# Altium schematic sheet MotorControl.SchDoc
size A2; DocumentNumber: 2; SheetNumber: 2; SheetTotal: 9
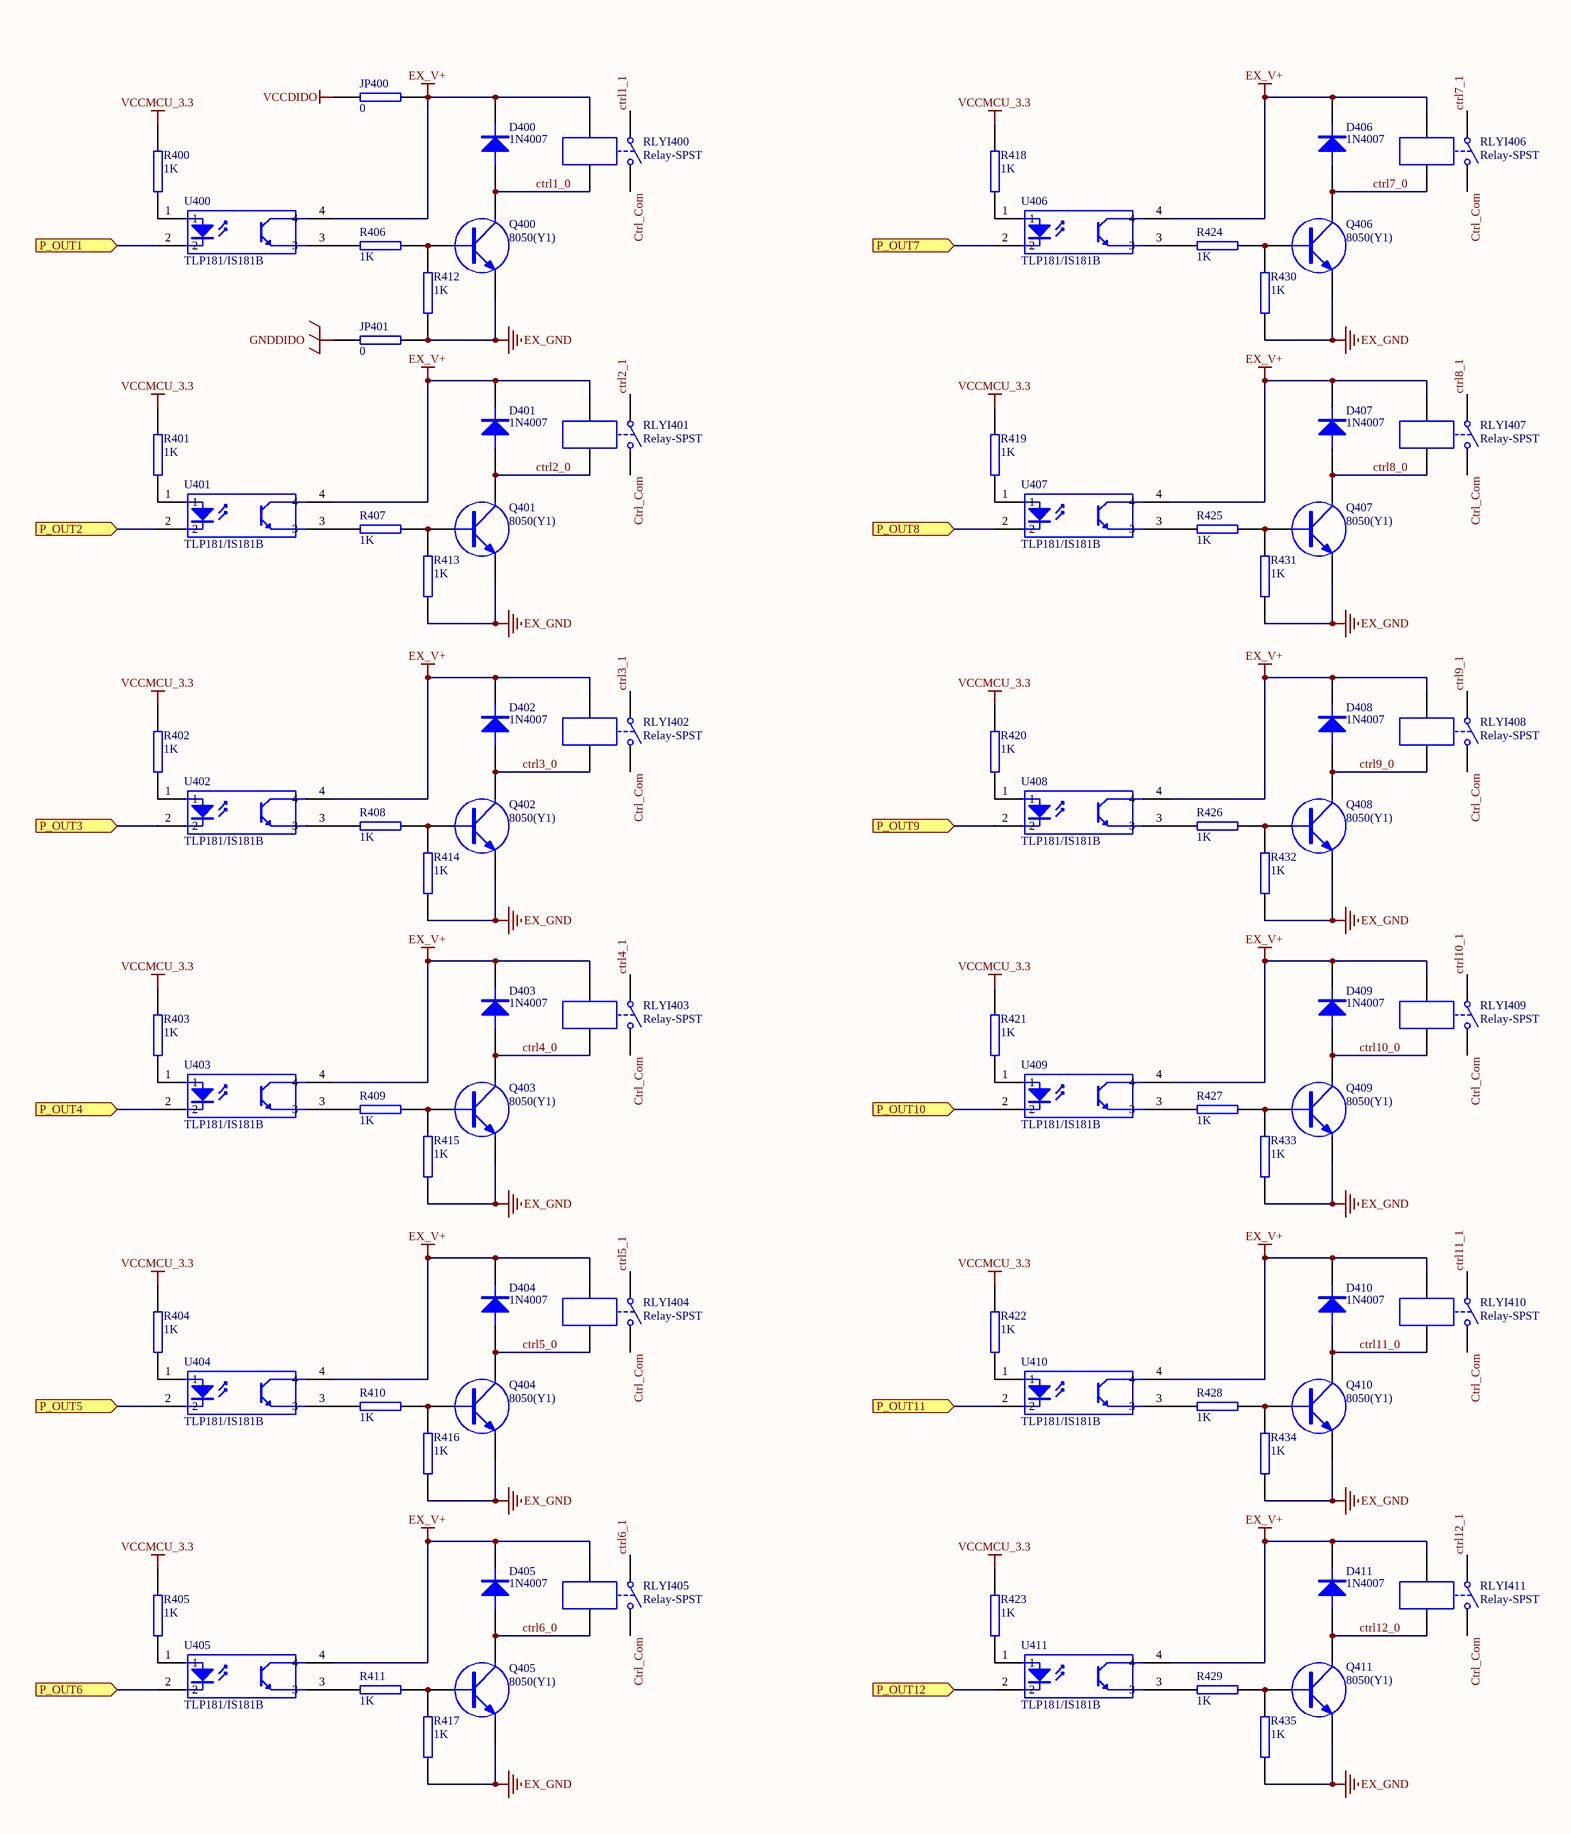
[diagram p0: MotorControl.SchDoc, left]
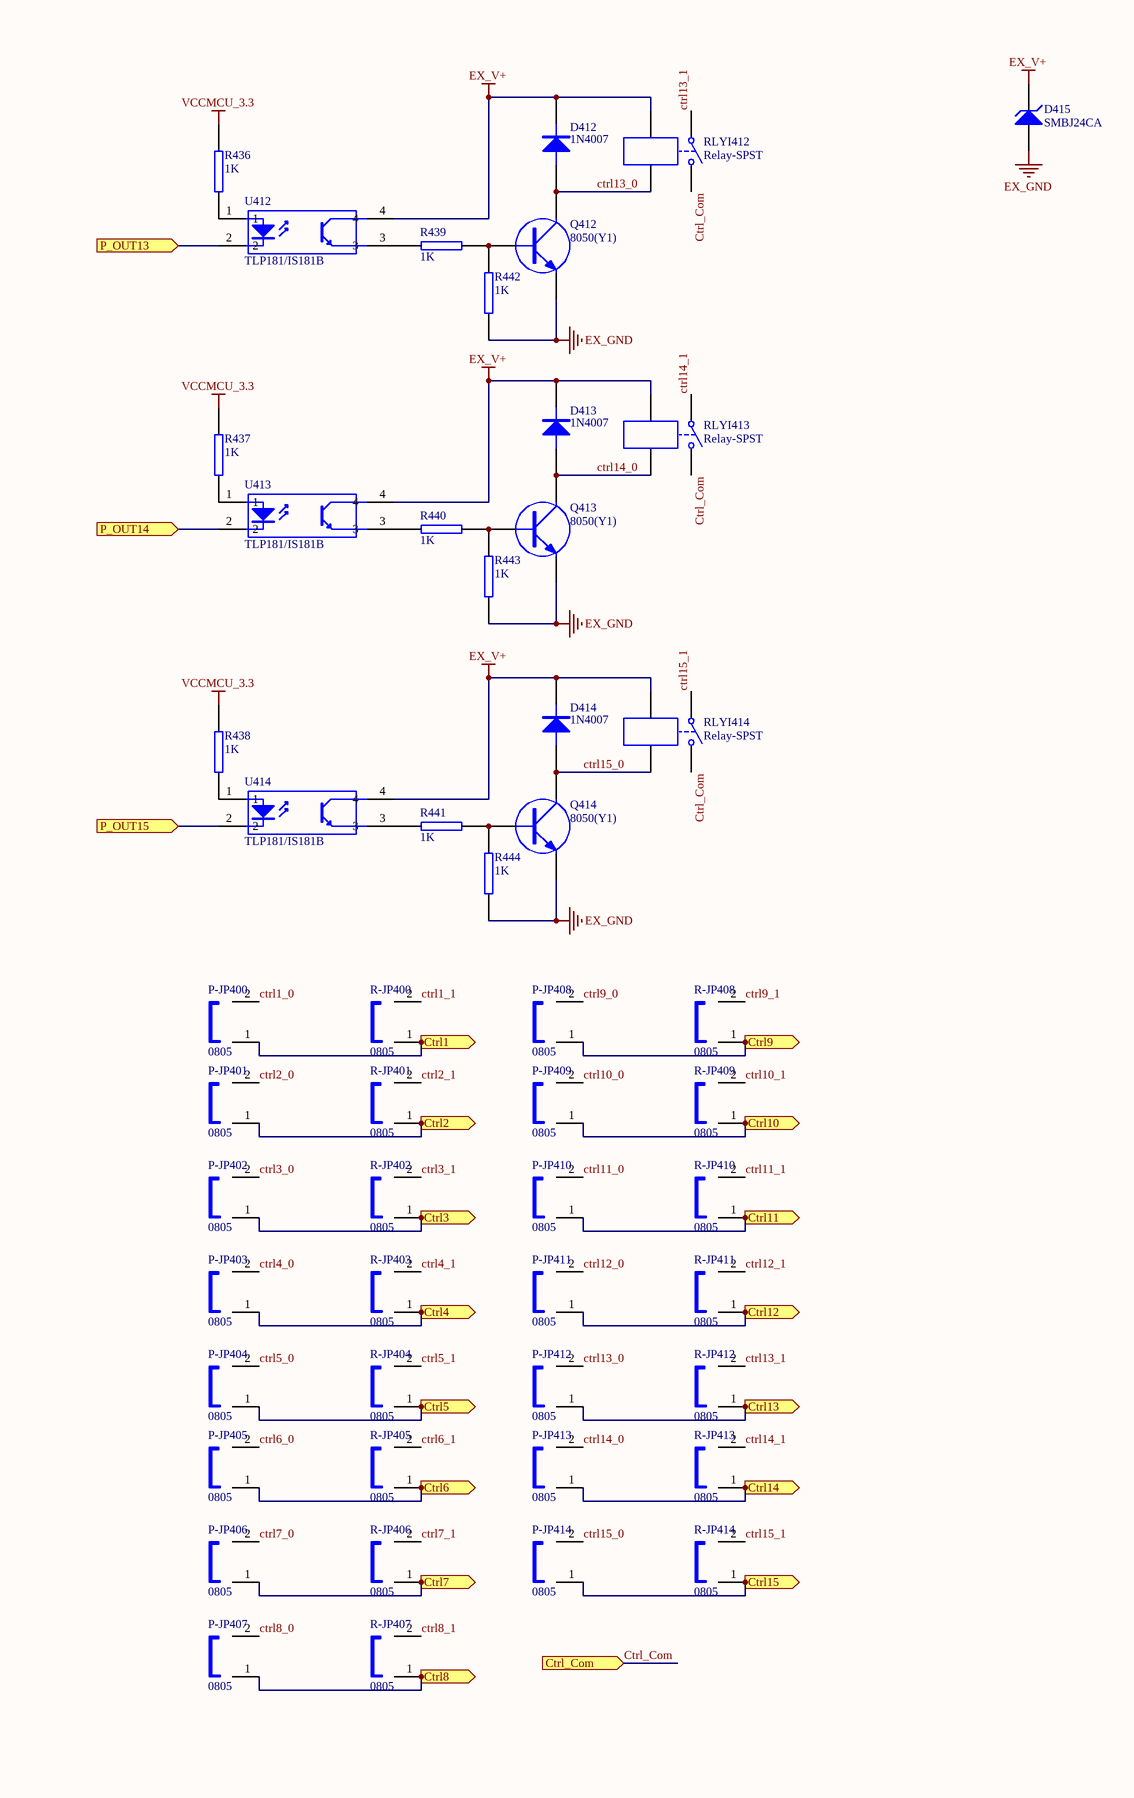
[diagram p1: MotorControl.SchDoc, right]

## Parts
D400  1N4007  [SMA]
D401  1N4007  [SMA]
D402  1N4007  [SMA]
D403  1N4007  [SMA]
D404  1N4007  [SMA]
D405  1N4007  [SMA]
D406  1N4007  [SMA]
D407  1N4007  [SMA]
D408  1N4007  [SMA]
D409  1N4007  [SMA]
D410  1N4007  [SMA]
D411  1N4007  [SMA]
D412  1N4007  [SMA]
D413  1N4007  [SMA]
D414  1N4007  [SMA]
D415  SMBJ24CA  [SMB]
JP400  0  [RESC_E0805_2012X50N]
JP401  0  [RESC_E0805_2012X50N]
P-JP400  0805  [RESC_E0805_2012X50N]
P-JP401  0805  [RESC_E0805_2012X50N]
P-JP402  0805  [RESC_E0805_2012X50N]
P-JP403  0805  [RESC_E0805_2012X50N]
P-JP404  0805  [RESC_E0805_2012X50N]
P-JP405  0805  [RESC_E0805_2012X50N]
P-JP406  0805  [RESC_E0805_2012X50N]
P-JP407  0805  [RESC_E0805_2012X50N]
P-JP408  0805  [RESC_E0805_2012X50N]
P-JP409  0805  [RESC_E0805_2012X50N]
P-JP410  0805  [RESC_E0805_2012X50N]
P-JP411  0805  [RESC_E0805_2012X50N]
P-JP412  0805  [RESC_E0805_2012X50N]
P-JP413  0805  [RESC_E0805_2012X50N]
P-JP414  0805  [RESC_E0805_2012X50N]
Q400  8050(Y1)  [SOT23_95P280X110-3N]
Q401  8050(Y1)  [SOT23_95P280X110-3N]
Q402  8050(Y1)  [SOT23_95P280X110-3N]
Q403  8050(Y1)  [SOT23_95P280X110-3N]
Q404  8050(Y1)  [SOT23_95P280X110-3N]
Q405  8050(Y1)  [SOT23_95P280X110-3N]
Q406  8050(Y1)  [SOT23_95P280X110-3N]
Q407  8050(Y1)  [SOT23_95P280X110-3N]
Q408  8050(Y1)  [SOT23_95P280X110-3N]
Q409  8050(Y1)  [SOT23_95P280X110-3N]
Q410  8050(Y1)  [SOT23_95P280X110-3N]
Q411  8050(Y1)  [SOT23_95P280X110-3N]
Q412  8050(Y1)  [SOT23_95P280X110-3N]
Q413  8050(Y1)  [SOT23_95P280X110-3N]
Q414  8050(Y1)  [SOT23_95P280X110-3N]
R400  1K  [RESC_E0805_2012X50N]
R401  1K  [RESC_E0805_2012X50N]
R402  1K  [RESC_E0805_2012X50N]
R403  1K  [RESC_E0805_2012X50N]
R404  1K  [RESC_E0805_2012X50N]
R405  1K  [RESC_E0805_2012X50N]
R406  1K  [RESC_E0805_2012X50N]
R407  1K  [RESC_E0805_2012X50N]
R408  1K  [RESC_E0805_2012X50N]
R409  1K  [RESC_E0805_2012X50N]
R410  1K  [RESC_E0805_2012X50N]
R411  1K  [RESC_E0805_2012X50N]
R412  1K  [RESC_E0805_2012X50N]
R413  1K  [RESC_E0805_2012X50N]
R414  1K  [RESC_E0805_2012X50N]
R415  1K  [RESC_E0805_2012X50N]
R416  1K  [RESC_E0805_2012X50N]
R417  1K  [RESC_E0805_2012X50N]
R418  1K  [RESC_E0805_2012X50N]
R419  1K  [RESC_E0805_2012X50N]
R420  1K  [RESC_E0805_2012X50N]
R421  1K  [RESC_E0805_2012X50N]
R422  1K  [RESC_E0805_2012X50N]
R423  1K  [RESC_E0805_2012X50N]
R424  1K  [RESC_E0805_2012X50N]
R425  1K  [RESC_E0805_2012X50N]
R426  1K  [RESC_E0805_2012X50N]
R427  1K  [RESC_E0805_2012X50N]
R428  1K  [RESC_E0805_2012X50N]
R429  1K  [RESC_E0805_2012X50N]
R430  1K  [RESC_E0805_2012X50N]
R431  1K  [RESC_E0805_2012X50N]
R432  1K  [RESC_E0805_2012X50N]
R433  1K  [RESC_E0805_2012X50N]
R434  1K  [RESC_E0805_2012X50N]
R435  1K  [RESC_E0805_2012X50N]
R436  1K  [RESC_E0805_2012X50N]
R437  1K  [RESC_E0805_2012X50N]
R438  1K  [RESC_E0805_2012X50N]
R439  1K  [RESC_E0805_2012X50N]
R440  1K  [RESC_E0805_2012X50N]
R441  1K  [RESC_E0805_2012X50N]
R442  1K  [RESC_E0805_2012X50N]
R443  1K  [RESC_E0805_2012X50N]
R444  1K  [RESC_E0805_2012X50N]
R-JP400  0805  [RESC_E0805_2012X50N]
R-JP401  0805  [RESC_E0805_2012X50N]
R-JP402  0805  [RESC_E0805_2012X50N]
R-JP403  0805  [RESC_E0805_2012X50N]
R-JP404  0805  [RESC_E0805_2012X50N]
R-JP405  0805  [RESC_E0805_2012X50N]
R-JP406  0805  [RESC_E0805_2012X50N]
R-JP407  0805  [RESC_E0805_2012X50N]
R-JP408  0805  [RESC_E0805_2012X50N]
R-JP409  0805  [RESC_E0805_2012X50N]
R-JP410  0805  [RESC_E0805_2012X50N]
R-JP411  0805  [RESC_E0805_2012X50N]
R-JP412  0805  [RESC_E0805_2012X50N]
R-JP413  0805  [RESC_E0805_2012X50N]
R-JP414  0805  [RESC_E0805_2012X50N]
RLYI400  Relay-SPST  [JDQ24V]
RLYI401  Relay-SPST  [JDQ24V]
RLYI402  Relay-SPST  [JDQ24V]
RLYI403  Relay-SPST  [JDQ24V]
RLYI404  Relay-SPST  [JDQ24V]
RLYI405  Relay-SPST  [JDQ24V]
RLYI406  Relay-SPST  [JDQ24V]
RLYI407  Relay-SPST  [JDQ24V]
RLYI408  Relay-SPST  [JDQ24V]
RLYI409  Relay-SPST  [JDQ24V]
RLYI410  Relay-SPST  [JDQ24V]
RLYI411  Relay-SPST  [JDQ24V]
RLYI412  Relay-SPST  [JDQ24V]
RLYI413  Relay-SPST  [JDQ24V]
RLYI414  Relay-SPST  [JDQ24V]
U400  TLP181/IS181B  [TLP181]
U401  TLP181/IS181B  [TLP181]
U402  TLP181/IS181B  [TLP181]
U403  TLP181/IS181B  [TLP181]
U404  TLP181/IS181B  [TLP181]
U405  TLP181/IS181B  [TLP181]
U406  TLP181/IS181B  [TLP181]
U407  TLP181/IS181B  [TLP181]
U408  TLP181/IS181B  [TLP181]
U409  TLP181/IS181B  [TLP181]
U410  TLP181/IS181B  [TLP181]
U411  TLP181/IS181B  [TLP181]
U412  TLP181/IS181B  [TLP181]
U413  TLP181/IS181B  [TLP181]
U414  TLP181/IS181B  [TLP181]

## Ports
Ctrl1 (out), Ctrl2 (out), Ctrl3 (out), Ctrl4 (out), Ctrl5 (out), Ctrl6 (out), Ctrl7 (out), Ctrl8 (out), Ctrl9 (out), Ctrl10 (out), Ctrl11 (out), Ctrl12 (out), Ctrl13 (out), Ctrl14 (out), Ctrl15 (out), Ctrl_Com (in), P_OUT1 (in), P_OUT2 (in), P_OUT3 (in), P_OUT4 (in), P_OUT5 (in), P_OUT6 (in), P_OUT7 (in), P_OUT8 (in), P_OUT9 (in), P_OUT10 (in), P_OUT11 (in), P_OUT12 (in), P_OUT13 (in), P_OUT14 (in), P_OUT15 (in)

## Nets
EX_GND: D415.1(A) JP401.1 Q400.2(E) Q401.2(E) Q402.2(E) Q403.2(E) Q404.2(E) Q405.2(E) Q406.2(E) Q407.2(E) Q408.2(E) Q409.2(E) Q410.2(E) Q411.2(E) Q412.2(E) Q413.2(E) Q414.2(E) R412.1 R413.1 R414.1 R415.1 R416.1 R417.1 R430.1 R431.1 R432.1 R433.1 R434.1 R435.1 R442.1 R443.1 R444.1
EX_V+: D400.2(K) D401.2(K) D402.2(K) D403.2(K) D404.2(K) D405.2(K) D406.2(K) D407.2(K) D408.2(K) D409.2(K) D410.2(K) D411.2(K) D412.2(K) D413.2(K) D414.2(K) D415.2(K) JP400.1 RLYI400.3 RLYI401.3 RLYI402.3 RLYI403.3 RLYI404.3 RLYI405.3 RLYI406.3 RLYI407.3 RLYI408.3 RLYI409.3 RLYI410.3 RLYI411.3 RLYI412.3 RLYI413.3 RLYI414.3 U400.4 U401.4 U402.4 U403.4 U404.4 U405.4 U406.4 U407.4 U408.4 U409.4 U410.4 U411.4 U412.4 U413.4 U414.4
GNDDIDO: JP401.2
VCCDIDO: JP400.2
VCCMCU_3.3: R400.1 R401.1 R402.1 R403.1 R404.1 R405.1 R418.1 R419.1 R420.1 R421.1 R422.1 R423.1 R436.1 R437.1 R438.1
Ctrl1: P-JP400.1 R-JP400.1 ; port Ctrl1
ctrl1_0: D400.1(A) P-JP400.2 Q400.3(C) RLYI400.4
ctrl1_1: R-JP400.2 RLYI400.1
Ctrl2: P-JP401.1 R-JP401.1 ; port Ctrl2
ctrl2_0: D401.1(A) P-JP401.2 Q401.3(C) RLYI401.4
ctrl2_1: R-JP401.2 RLYI401.1
Ctrl3: P-JP402.1 R-JP402.1 ; port Ctrl3
ctrl3_0: D402.1(A) P-JP402.2 Q402.3(C) RLYI402.4
ctrl3_1: R-JP402.2 RLYI402.1
Ctrl4: P-JP403.1 R-JP403.1 ; port Ctrl4
ctrl4_0: D403.1(A) P-JP403.2 Q403.3(C) RLYI403.4
ctrl4_1: R-JP403.2 RLYI403.1
Ctrl5: P-JP404.1 R-JP404.1 ; port Ctrl5
ctrl5_0: D404.1(A) P-JP404.2 Q404.3(C) RLYI404.4
ctrl5_1: R-JP404.2 RLYI404.1
Ctrl6: P-JP405.1 R-JP405.1 ; port Ctrl6
ctrl6_0: D405.1(A) P-JP405.2 Q405.3(C) RLYI405.4
ctrl6_1: R-JP405.2 RLYI405.1
Ctrl7: P-JP406.1 R-JP406.1 ; port Ctrl7
ctrl7_0: D406.1(A) P-JP406.2 Q406.3(C) RLYI406.4
ctrl7_1: R-JP406.2 RLYI406.1
Ctrl8: P-JP407.1 R-JP407.1 ; port Ctrl8
ctrl8_0: D407.1(A) P-JP407.2 Q407.3(C) RLYI407.4
ctrl8_1: R-JP407.2 RLYI407.1
Ctrl9: P-JP408.1 R-JP408.1 ; port Ctrl9
ctrl9_0: D408.1(A) P-JP408.2 Q408.3(C) RLYI408.4
ctrl9_1: R-JP408.2 RLYI408.1
Ctrl10: P-JP409.1 R-JP409.1 ; port Ctrl10
ctrl10_0: D409.1(A) P-JP409.2 Q409.3(C) RLYI409.4
ctrl10_1: R-JP409.2 RLYI409.1
Ctrl11: P-JP410.1 R-JP410.1 ; port Ctrl11
ctrl11_0: D410.1(A) P-JP410.2 Q410.3(C) RLYI410.4
ctrl11_1: R-JP410.2 RLYI410.1
Ctrl12: P-JP411.1 R-JP411.1 ; port Ctrl12
ctrl12_0: D411.1(A) P-JP411.2 Q411.3(C) RLYI411.4
ctrl12_1: R-JP411.2 RLYI411.1
Ctrl13: P-JP412.1 R-JP412.1 ; port Ctrl13
ctrl13_0: D412.1(A) P-JP412.2 Q412.3(C) RLYI412.4
ctrl13_1: R-JP412.2 RLYI412.1
Ctrl14: P-JP413.1 R-JP413.1 ; port Ctrl14
ctrl14_0: D413.1(A) P-JP413.2 Q413.3(C) RLYI413.4
ctrl14_1: R-JP413.2 RLYI413.1
Ctrl15: P-JP414.1 R-JP414.1 ; port Ctrl15
ctrl15_0: D414.1(A) P-JP414.2 Q414.3(C) RLYI414.4
ctrl15_1: R-JP414.2 RLYI414.1
Ctrl_Com: RLYI400.2 RLYI401.2 RLYI402.2 RLYI403.2 RLYI404.2 RLYI405.2 RLYI406.2 RLYI407.2 RLYI408.2 RLYI409.2 RLYI410.2 RLYI411.2 RLYI412.2 RLYI413.2 RLYI414.2 ; port Ctrl_Com
P_OUT1: U400.2 ; port P_OUT1
P_OUT2: U401.2 ; port P_OUT2
P_OUT3: U402.2 ; port P_OUT3
P_OUT4: U403.2 ; port P_OUT4
P_OUT5: U404.2 ; port P_OUT5
P_OUT6: U405.2 ; port P_OUT6
P_OUT7: U406.2 ; port P_OUT7
P_OUT8: U407.2 ; port P_OUT8
P_OUT9: U408.2 ; port P_OUT9
P_OUT10: U409.2 ; port P_OUT10
P_OUT11: U410.2 ; port P_OUT11
P_OUT12: U411.2 ; port P_OUT12
P_OUT13: U412.2 ; port P_OUT13
P_OUT14: U413.2 ; port P_OUT14
P_OUT15: U414.2 ; port P_OUT15
NetQ400_1: Q400.1(B) R406.1 R412.2
NetQ401_1: Q401.1(B) R407.1 R413.2
NetQ402_1: Q402.1(B) R408.1 R414.2
NetQ403_1: Q403.1(B) R409.1 R415.2
NetQ404_1: Q404.1(B) R410.1 R416.2
NetQ405_1: Q405.1(B) R411.1 R417.2
NetQ406_1: Q406.1(B) R424.1 R430.2
NetQ407_1: Q407.1(B) R425.1 R431.2
NetQ408_1: Q408.1(B) R426.1 R432.2
NetQ409_1: Q409.1(B) R427.1 R433.2
NetQ410_1: Q410.1(B) R428.1 R434.2
NetQ411_1: Q411.1(B) R429.1 R435.2
NetQ412_1: Q412.1(B) R439.1 R442.2
NetQ413_1: Q413.1(B) R440.1 R443.2
NetQ414_1: Q414.1(B) R441.1 R444.2
NetR400_2: R400.2 U400.1
NetR401_2: R401.2 U401.1
NetR402_2: R402.2 U402.1
NetR403_2: R403.2 U403.1
NetR404_2: R404.2 U404.1
NetR405_2: R405.2 U405.1
NetR406_2: R406.2 U400.3
NetR407_2: R407.2 U401.3
NetR408_2: R408.2 U402.3
NetR409_2: R409.2 U403.3
NetR410_2: R410.2 U404.3
NetR411_2: R411.2 U405.3
NetR418_2: R418.2 U406.1
NetR419_2: R419.2 U407.1
NetR420_2: R420.2 U408.1
NetR421_2: R421.2 U409.1
NetR422_2: R422.2 U410.1
NetR423_2: R423.2 U411.1
NetR424_2: R424.2 U406.3
NetR425_2: R425.2 U407.3
NetR426_2: R426.2 U408.3
NetR427_2: R427.2 U409.3
NetR428_2: R428.2 U410.3
NetR429_2: R429.2 U411.3
NetR436_2: R436.2 U412.1
NetR437_2: R437.2 U413.1
NetR438_2: R438.2 U414.1
NetR439_2: R439.2 U412.3
NetR440_2: R440.2 U413.3
NetR441_2: R441.2 U414.3

## Library data of the parts
D400-D414 = DIODE
D415 = D Zener: Zener Diode; Published: 8-Jun-2000; LatestRevisionDate: 17-Jul-2002; LatestRevisionNote: Re-released for DXP Platform.; PackageReference: DIODE-0.7; Publisher: Altium Limited
JP400 JP401 R400-R444 = RES2
P-JP400-P-JP414 R-JP400-R-JP414 = JUMPER
Q400-Q414 = BSS64
RLYI400-RLYI414 = Relay-SPST: Single-Pole Single-Throw Relay; Published: 24-Mar-1999; LatestRevisionDate: 17-Jul-2002; LatestRevisionNote: Re-released for DXP Platform.; PackageReference: MODULE4; Publisher: Altium Limited
U400-U414 = TLP181: 光耦隔离